# EAGLE design hall_shield (EAGLE 6.3)
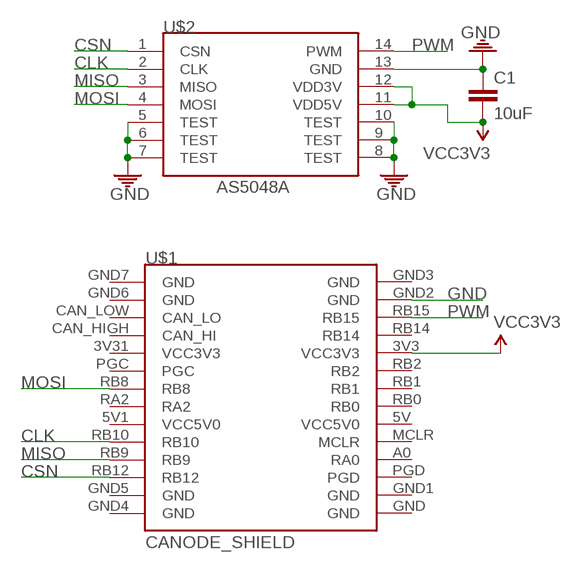
[diagram p0: schematic, sheet 1]

## Parts
C1  10uF  CAP1206  [1206]
U$1  CANODE_SHIELD  [CANODE_SHIELD]
U$2  AS5048A  [TSSOP14]

## Nets
CLK [small]: U$1.RB10 U$2.2(CLK)
CSN [small]: U$1.RB12 U$2.1(CSN)
GND: C1.1 U$1.GND2(GND) U$2.5(TEST) U$2.6(TEST) U$2.7(TEST) U$2.8(TEST) U$2.9(TEST) U$2.10(TEST) U$2.13(GND)
MISO [small]: U$1.RB9 U$2.3(MISO)
MOSI [small]: U$1.RB8 U$2.4(MOSI)
PWM: U$1.RB15 U$2.14(PWM)
VCC3V3: C1.2 U$1.3V3(VCC3V3) U$2.11(VDD5V) U$2.12(VDD3V)
Unconnected: U$1.3V31(VCC3V3) U$1.5V1(VCC5V0) U$1.5V(VCC5V0) U$1.A0(RA0) U$1.CAN_HIGH(CAN_HI) U$1.CAN_LOW(CAN_LO) U$1.GND U$1.GND1(GND) U$1.GND3(GND) U$1.GND4(GND) U$1.GND5(GND) U$1.GND6(GND) U$1.GND7(GND) U$1.MCLR U$1.PGC U$1.PGD U$1.RA2 U$1.RB0 U$1.RB1 U$1.RB2 U$1.RB14

## Library data of the parts
C1 = ASL:CAP: Capacitor Standard 0603 ceramic capacitor, and 0.1" leaded capacitor.
U$1 = ASL:CANODE_SHIELD: This part provides an outline of the CANode to facilitate developing shield boards. Note that this does not show the position of the mounting holes for the 4-40 screws, which should be .12" holes centered in the 4 circles in the corners.
U$2 = ASL:AS5048A: A hall-effect encoder by Austria Micro. Provides 14-bit resolution of the absolute angle of a rotary magnet.

## Net classes
0 default: width 0.406 mm
1 small: width 0.203 mm

## Board
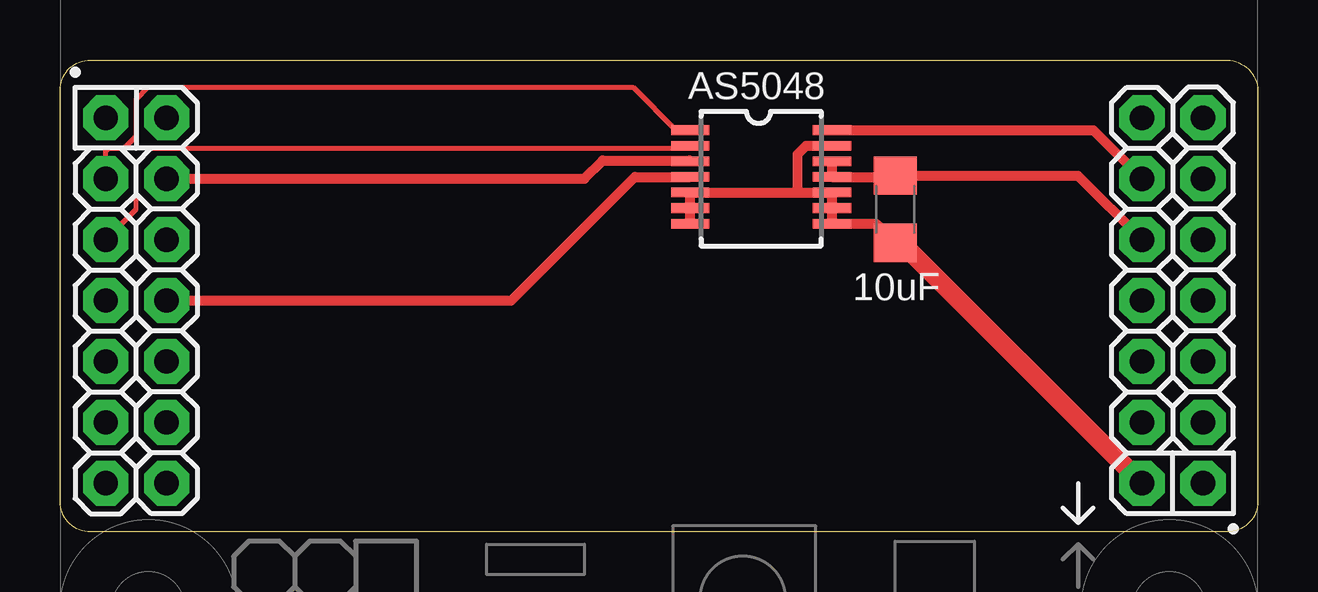
[diagram p1: board, top side]

Size 49.91 x 19.68 mm. Coordinates in mm from the lower left corner, seen from the top.
Outline: 1.27,19.68 48.64,19.68 arc-90 49.91,18.29 49.91,1.27 arc-90 48.64,0 1.27,0 arc-90 0,1.27 0,18.41 arc-90 1.27,19.68
Copper layers (1*16): Top 0.035mm / dielectric 1.5mm / Bottom 0.035mm
Design rules "default *": minimum track width 8mil, minimum drill 23mil, track to track 8mil, track to pad 8mil, pad to pad 8mil, via to via 8mil, smd to smd 8mil, copper to edge 40mil, drill to drill 8mil, minimum pad ring 10mil, minimum via ring 8mil, stop-mask expansion 4mil, vias tented up to drill 0mil, thermal gap 10mil

### Footprints (pad centres in the part's own frame; a part is rotated, then mirrored left to right if it is on the bottom)
1206 = smd 1.6 x 1.8: 1 -1.4,0; 2 1.4,0
CANODE_SHIELD = drill 1.016 pad 1.88 octagon: 3V3 45.085,19.05; 3V31 4.445,13.97; 5V 45.085,13.97; 5V1 4.445,19.05; A0 45.085,11.43; CAN_HIGH 1.905,11.43; CAN_LOW 4.445,11.43; GND 45.085,24.13; GND1 47.625,24.13; GND2 45.085,8.89; GND3 47.625,8.89; GND4 4.445,8.89; GND5 1.905,8.89; GND6 4.445,24.13; GND7 1.905,24.13; MCLR 47.625,13.97; PGC 1.905,13.97; PGD 47.625,11.43; RA2 1.905,16.51; RB0 47.625,16.51; RB1 45.085,16.51; RB2 47.625,19.05; RB8 4.445,16.51; RB9 4.445,21.59; RB10 1.905,19.05; RB12 1.905,21.59; RB14 47.625,21.59; RB15 45.085,21.59
TSSOP14 = smd 0.4 x 1.6: 1 -2.025,-2.95; 2 -1.375,-2.95; 3 -0.725,-2.95; 4 -0.075,-2.95; 5 0.575,-2.95; 6 1.225,-2.95; 7 1.875,-2.95; 8 1.875,2.95; 9 1.225,2.95; 10 0.575,2.95; 11 -0.075,2.95; 12 -0.725,2.95; 13 -1.375,2.95; 14 -2.025,2.95

### Placement (x,y rotation side)
C1  34.8,13.46 90 top
U$1  0,-6.86 0 top
U$2  29.21,14.73 270 top

### Tracks (layer width: path | path; a pad name or v marks a point on that pad's centre or on a via)
CLK
  Top 0.203: U$1.RB10 3.17,13.46 3.17,15.37 3.81,16 26.16,16 U$2.2
CSN
  Top 0.203: U$2.1 26.25,16.76 25.65,16.76 23.88,18.54 3.68,18.54 3.17,18.03 3.17,16.51 2.67,16 2.03,16 1.91,15.88 U$1.RB12
GND
  Top 0.406: 30.73,14.16 U$2.5 U$2.6 U$2.7 | 30.73,14.16 U$2.10 U$2.9 U$2.8 34,12.86 C1.1 35.05,12.06 | U$2.13 31.09,16.11 30.73,15.75 30.73,14.16
  Top 0.762: 35.05,12.06 U$1.GND2
MISO
  Top 0.406: U$1.RB9 21.84,14.73 22.61,15.49 26.22,15.49 U$2.3
MOSI
  Top 0.406: U$1.RB8 18.8,9.65 23.95,14.81 U$2.4
PWM
  Top 0.406: U$2.14 43.06,16.76 U$1.RB15
VCC3V3
  Top 0.406: U$2.12 U$2.11 34.74,14.81 C1.2 42.41,14.86 U$1.3V3

### Text on the board
tPlace: AS5048 | 10uF